# EAGLE design Qwiic_OLED_1.3in (EAGLE 9.6.2)
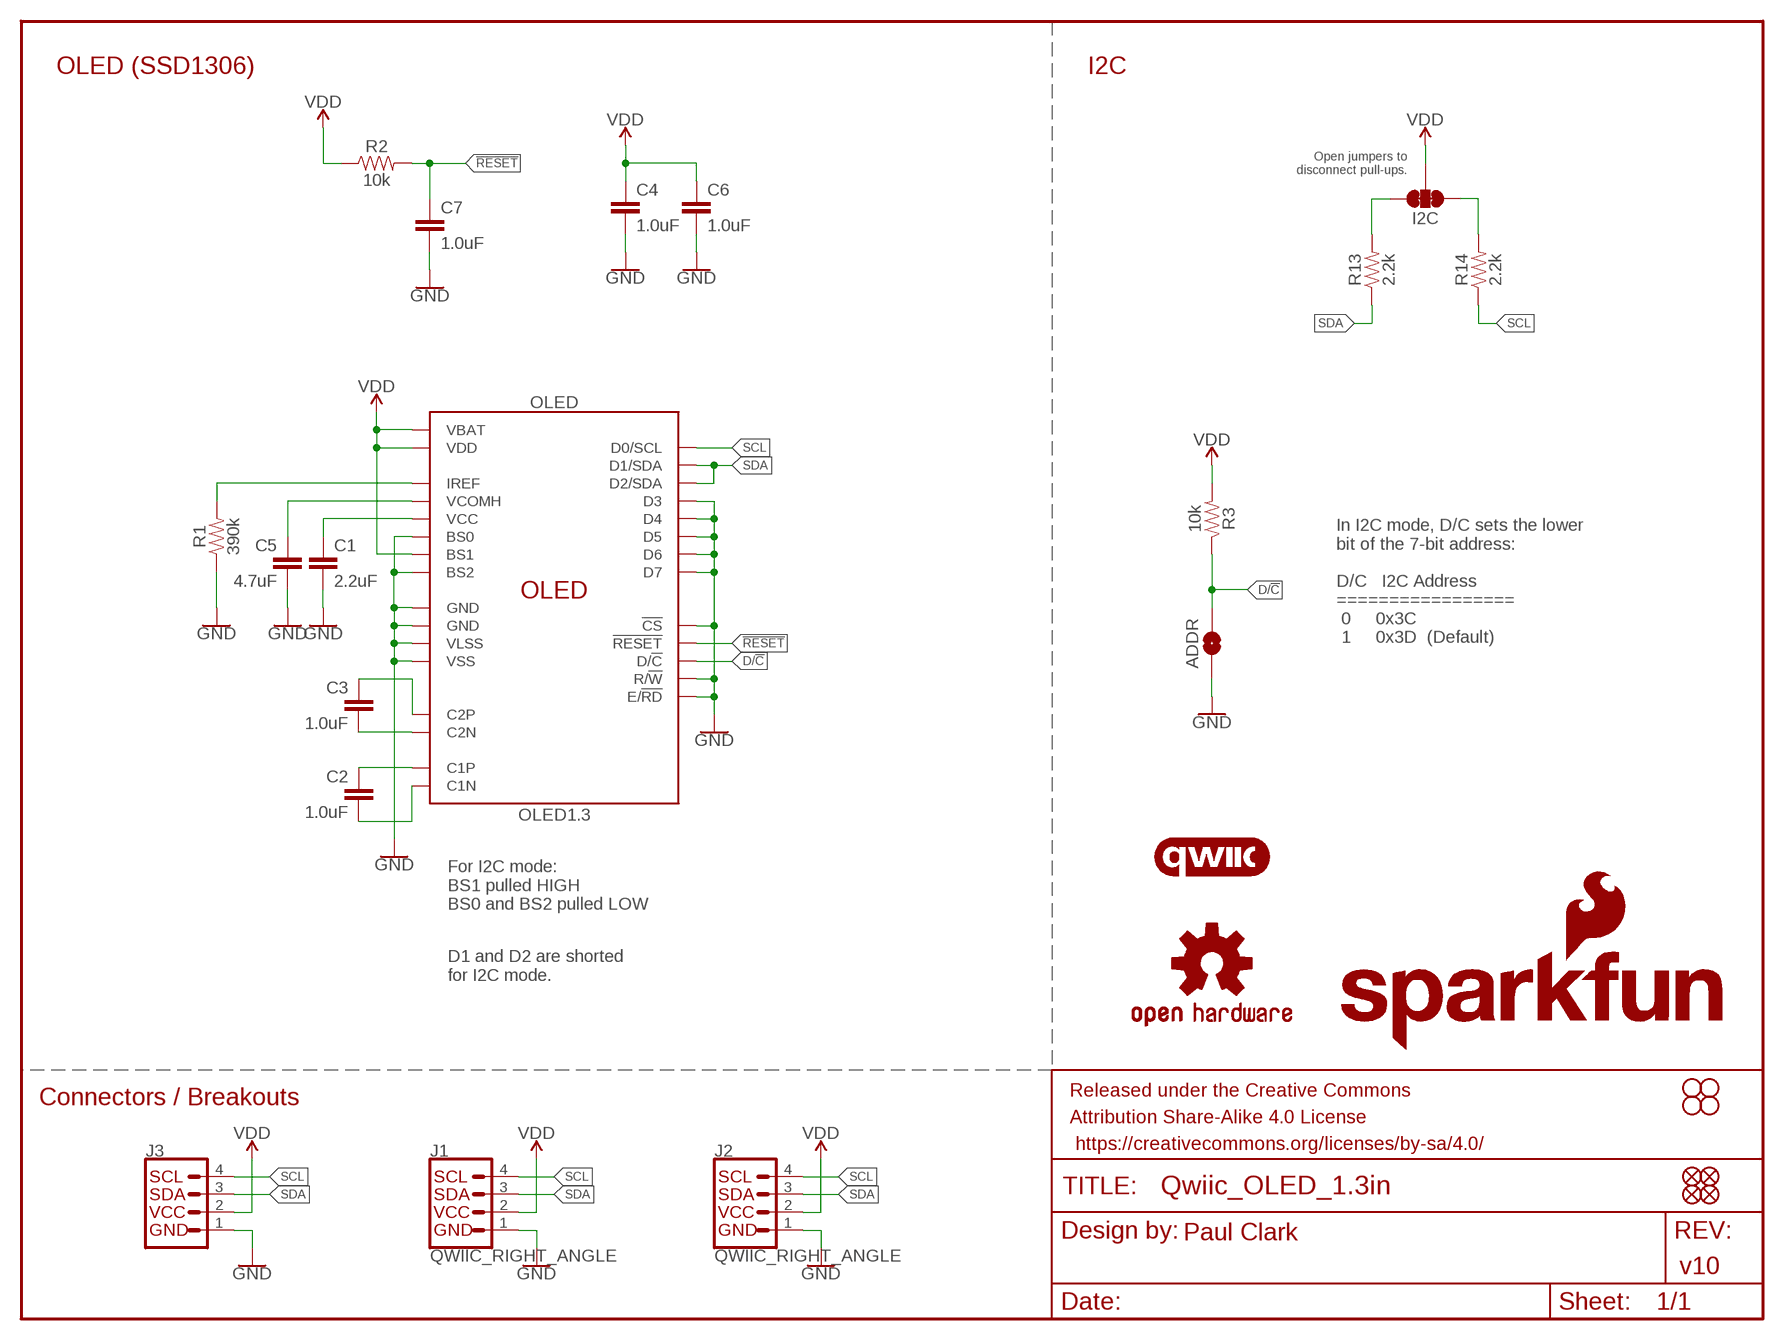
[diagram p0: schematic, sheet 1]

## Parts
ADDR  JUMPER-SMT_2_NO_SILK  [SMT-JUMPER_2_NO_SILK]
C1  2.2uF  2.2UF-0603-10V-20%  [0603]
C2  1.0uF  1.0UF-0603-16V-10%-X7R  [0603]
C3  1.0uF  1.0UF-0603-16V-10%-X7R  [0603]
C4  1.0uF  1.0UF-0603-16V-10%-X7R  [0603]
C5  4.7uF  4.7UF-0603-35V-(20%)  [0603]
C6  1.0uF  1.0UF-0603-16V-10%-X7R  [0603]
C7  1.0uF  1.0UF-0603-16V-10%-X7R  [0603]
FID1  FIDUCIAL1X2  [FIDUCIAL-1X2]
FID2  FIDUCIAL1X2  [FIDUCIAL-1X2]
FID3  FIDUCIAL1X2  [FIDUCIAL-1X2]
FID4  FIDUCIAL1X2  [FIDUCIAL-1X2]
FRAME1  FRAME-LETTER  [CREATIVE_COMMONS]
H1  STAND-OFF  [STAND-OFF]
H2  STAND-OFF  [STAND-OFF]
H3  STAND-OFF  [STAND-OFF]
H4  STAND-OFF  [STAND-OFF]
I2C  JUMPER-SMT_3_2-NC_TRACE_SILK  [SMT-JUMPER_3_2-NC_TRACE_SILK]
J1  QWIIC_RIGHT_ANGLE  QWIIC_CONNECTORJS-1MM  [JST04_1MM_RA]
J2  QWIIC_RIGHT_ANGLE  QWIIC_CONNECTORJS-1MM  [JST04_1MM_RA]
J3  I2C_STANDARD_NO_SILK  [1X04_NO_SILK]
LOGO1  QWIIC_LOGO_6MM  [QWIIC_6MM]
LOGO3  OSHW-LOGOS  [OSHW-LOGO-S]
LOGO4  SFE_LOGO_NAME_FLAME.1_INCH  [SFE_LOGO_NAME_FLAME_.1]
OLED  OLED1.3  [OLED-1.3-128X64]
R1  390k  390KOHM-0603-1/10W-1%  [0603]
R2  10k  10KOHM-0603-1/10W-1%  [0603]
R3  10k  10KOHM-0603-1/10W-1%  [0603]
R13  2.2k  2.2KOHM-0603-1/10W-1%  [0603]
R14  2.2k  2.2KOHM-0603-1/10W-1%  [0603]

## Nets
!RESET!: C7.1 OLED.14(!RESET!) R2.2
C1N: C2.2 OLED.5(C1N)
C1P: C2.1 OLED.4(C1P)
C2N: C3.2 OLED.3(C2N)
C2P: C3.1 OLED.2(C2P)
D/!C!: ADDR.2 OLED.15(D/!C!) R3.1
GND: ADDR.1 C1.2 C4.2 C5.2 C6.2 C7.2 J1.1 J2.1 J3.1(GND) OLED.1(GND) OLED.8(VSS) OLED.10(BS0) OLED.12(BS2) OLED.13(!CS!) OLED.16(R/!W!) OLED.17(E/!RD!) OLED.21(D3) OLED.22(D4) OLED.23(D5) OLED.24(D6) OLED.25(D7) OLED.29(VLSS) OLED.30(GND) R1.1
IREF: OLED.26(IREF) R1.2
N$4: I2C.3 R13.2
N$5: I2C.1 R14.2
SCL: J1.4 J2.4 J3.4(SCL) OLED.18(D0/SCL) R14.1
SDA: J1.3 J2.3 J3.3(SDA) OLED.19(D1/SDA) OLED.20(D2/SDA) R13.1
VCC: C1.1 OLED.28(VCC)
VCOMH: C5.1 OLED.27(VCOMH)
VDD: C4.1 C6.1 I2C.2 J1.2 J2.2 J3.2(VCC) OLED.6(VBAT) OLED.9(VDD) OLED.11(BS1) R2.1 R3.2

## Notes on the sheet
- OLED (SSD1306) | I2C
- Open jumpers to
  disconnect pull-ups.
- In I2C mode, D/C sets the lower
  bit of the 7-bit address:
  
  D/C   I2C Address
  =================
   0     0x3C
   1     0x3D  (Default)
- For I2C mode:
  BS1 pulled HIGH
  BS0 and BS2 pulled LOW
- D1 and D2 are shorted
  for I2C mode.
- Connectors / Breakouts
- Paul Clark
- v10

## Library data of the parts
ADDR = SparkFun-Jumpers:JUMPER-SMT_2_NO: Normally open jumper This jumper has two pads in close proximity to each other. Apply solder to close the connection. Round pads are easier to solder for beginners, but are a lot larger. SparkFun Product that uses the round pads: SparkFun EL Sequencer <https://www.sparkfun.com/products/12781>
C1 = SparkFun-Capacitors:2.2UF: 2.2µF ceramic capacitors A capacitor is a passive two-terminal electrical component used to store electrical energy temporarily in an electric field.; PROD_ID: CAP-07888
C2-C4 C6 C7 = SparkFun-Capacitors:1.0UF: 1µF ceramic capacitors A capacitor is a passive two-terminal electrical component used to store electrical energy temporarily in an electric field.; PROD_ID: CAP-13930
C5 = SparkFun-Capacitors:4.7UF: 4.7µF ceramic capacitors A capacitor is a passive two-terminal electrical component used to store electrical energy temporarily in an electric field.; PROD_ID: CAP-14106
FID1-FID4 = SparkFun-Aesthetics:FIDUCIAL: Fiducial Alignment Points Point-of-reference for pick-and-place machines and other optical instruments.
FRAME1 = SparkFun-Aesthetics:FRAME-LETTER: Schematic Frame - Letter Standard 8.5x11 US Letter frame
H1-H4 = SparkFun-Hardware:STAND-OFF: Stand Off Drill holes for mechanically mounting via screws, standoffs, etc. Note: Use the keepout ring to avoid running the screw head into surrounding components. Variant Overviews STAND-OFF - Mechanical footprint for a #4 phillips button head screw. STAND-OFF-TIGHT - Mechanical footprint for a #4 phillips button head screw, Example SparkFun Products Screw - Phillips Head (1/4", 4-40, 10 pack) <https://www.sparkfun.com/products/10453> (PRT-10453) Screw - Phillips Head (1/2", 4-40, 10 pack) <https://www.sparkfun.com/products/10452> (PRT-10452) Screw - Phillips Head (3/4", 4-40, 10 pack) <https://www.sparkfun.com/products/10451> (PRT-10451) Screw - Phillips Head (1", 4-40, 10 pack) <https://www.sparkfun.com/products/10450> (PRT-10450)
I2C = SparkFun-Jumpers:JUMPER-SMT_3_2-NC_TRACE: Normally closed trace jumper (2 of 2 connections) This jumper has a trace between all three pads so they are normally closed (NC). Use a razor knife to open the connection(s). For best results follow the IPC guidelines for cutting traces: Cutout at least 0.063 mm (0.005 in). Remove all loose material to clean up the cut area. Seal the cut with an approved epoxy. Reapply solder to reclose the connection(s).
J1 J2 = SparkFun-Connectors:QWIIC_CONNECTOR: SparkFun I2C Standard Qwiic Connector An SMD 1mm pitch JST connector makes it easy and quick (get it? Qwiic?) to connect I2C devices to each other. The Qwiic system <http://www.sparkfun.com/qwiic> enables fast and solderless connection between popular platforms and various sensors and actuators. We carry 200mm <https://www.sparkfun.com/products/14204>, 100mm <https://www.sparkfun.com/products/14205>, 50mm <https://www.sparkfun.com/products/14206>, and breadboard friendly <https://www.sparkfun.com/products/14207> Qwiic cables. We also offer 10 pcs strips <https://www.sparkfun.com/products/14323> the SMD connectors.; PROD_ID: CONN-13694
J3 = SparkX:I2C_STANDARD: SparkFun I2C Standard Pinout Header SparkFun has standardized on a pinout for all I2C based sensor breakouts. This pinout allows I2C boards to be plugged directly into the headers on Arduino Uno compatible boards, and to be daisy chained easily. Example SparkFun Products: SparkFun Atmospheric Sensor Breakout - BME280 <https://www.sparkfun.com/products/13676> SparkFun Altitude/Pressure Sensor Breakout - MPL3115A2 <https://www.sparkfun.com/products/11084> SparkFun TOF Range Finder Sensor - VL6180 <https://www.sparkfun.com/products/12785>
LOGO1 = SparkFun-Aesthetics:QWIIC_LOGO: Qwiic Logos for placement on schematic and PCB. The 5.5mm silk logo is best for placing next to Qwiic connector.
LOGO3 = SparkFun-Aesthetics:OSHW-LOGO: Open-Source Hardware (OSHW) Logo This logo indicates the piece of hardware it is found on incorporates a OSHW license and/or adheres to the definition of open source hardware found here: http://freedomdefined.org/OSHW
LOGO4 = SparkFun-Aesthetics:SFE_LOGO_NAME_FLAME: SparkFun Font Logo w/ Flame This is the SparkFun full logo. The logo on the schematic will always be the same size; the package variant is the height of the flame part of the logo. Default layer for the logo on the board is tSilk.
OLED = OLED_1.3in:OLED1.3: OLED 1.3" 128x64 SSD1306; PROD_ID: LCD-19994
R1 = SparkFun-Resistors:390KOHM: 390kΩ resistor A resistor is a passive two-terminal electrical component that implements electrical resistance as a circuit element. Resistors act to reduce current flow, and, at the same time, act to lower voltage levels within circuits. - Wikipedia; PROD_ID: RES-12024
R2 R3 = SparkFun-Resistors:10KOHM: 10kΩ resistor A resistor is a passive two-terminal electrical component that implements electrical resistance as a circuit element. Resistors act to reduce current flow, and, at the same time, act to lower voltage levels within circuits. - Wikipedia; PROD_ID: RES-00824
R13 R14 = SparkFun-Resistors:2.2KOHM: 2.2kΩ resistor A resistor is a passive two-terminal electrical component that implements electrical resistance as a circuit element. Resistors act to reduce current flow, and, at the same time, act to lower voltage levels within circuits. - Wikipedia; PROD_ID: RES-08272

## Board
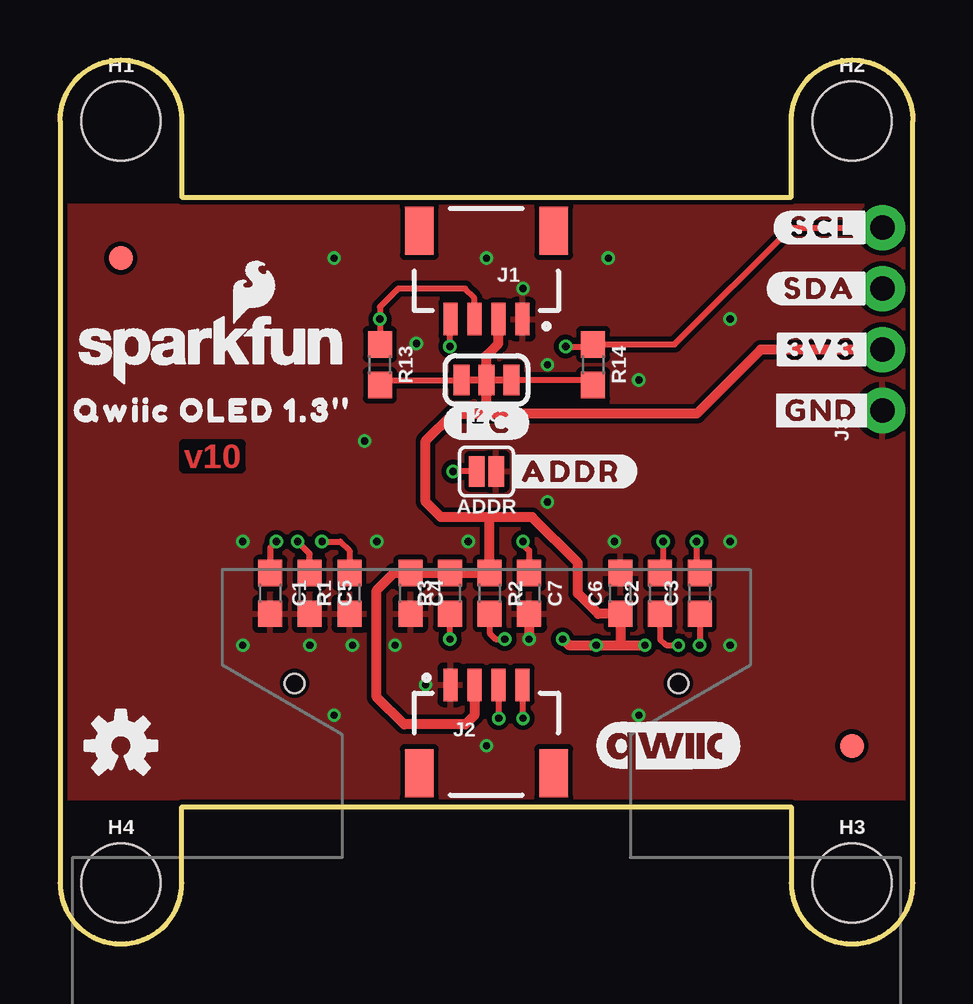
[diagram p1: board, top side]
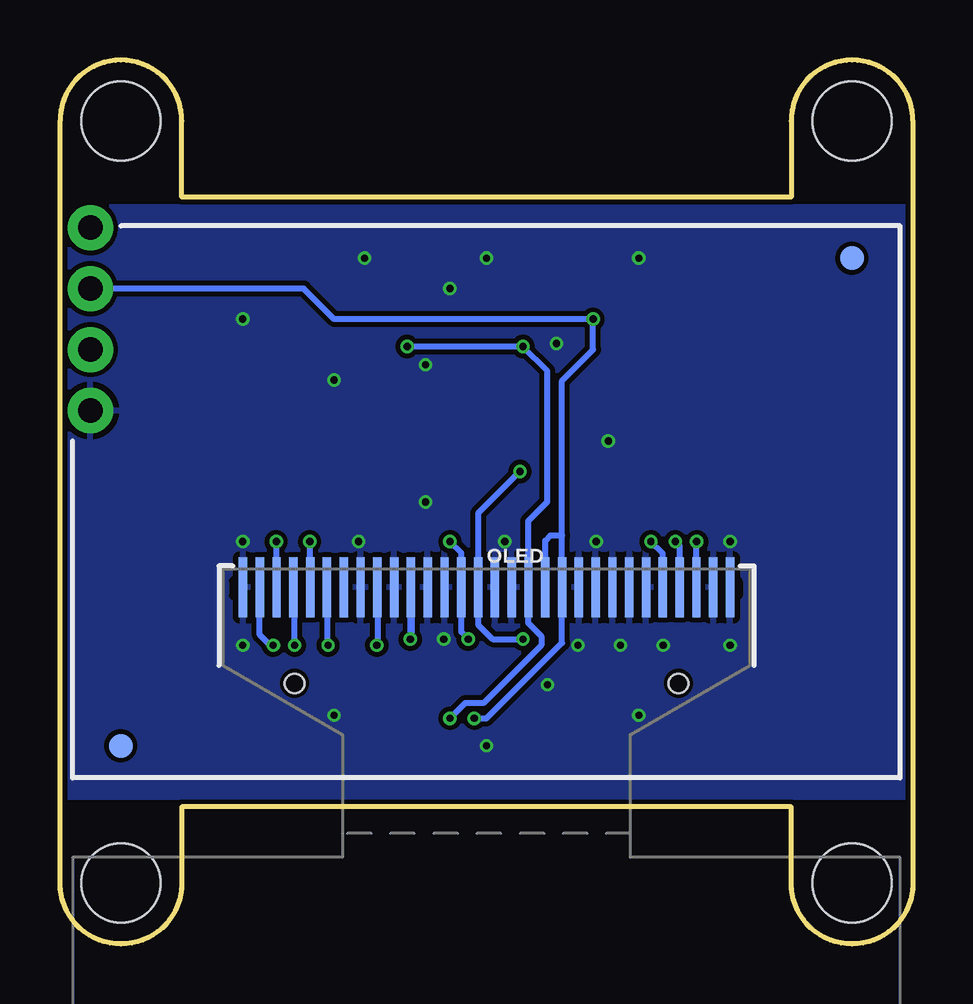
[diagram p2: board, bottom side, seen from below]

Size 35.56 x 36.83 mm. Coordinates in mm from the lower left corner, seen from the top.
Outline: 35.56,2.54 35.56,34.29 arc90 33.02,36.83 arc90 30.48,34.29 30.48,31.11 5.08,31.11 5.08,34.29 arc90 2.54,36.83 arc90 0,34.29 0,2.54 arc90 2.54,0 arc90 5.08,2.54 5.08,5.71 30.48,5.71 30.48,2.54 arc90 33.02,0 arc90 35.56,2.54
Copper layers (1*16): Top 0.035mm / dielectric 1.5mm / Bottom 0.035mm
Design rules "SparkFun-2-Layer-Minimum-JLCPCB": minimum track width 5mil, minimum drill 0.3mm, track to track 5mil, track to pad 5mil, pad to pad 5mil, via to via 5mil, smd to smd 5mil, copper to edge 7mil, drill to drill 7mil, minimum pad ring 5mil, minimum via ring 5mil, stop-mask expansion 2.5mil, vias tented up to drill 25mil, thermal gap 10mil
bRestrict: 9 lines

### Footprints (pad centres in the part's own frame; a part is rotated, then mirrored left to right if it is on the bottom)
SMT-JUMPER_2_NO_SILK = smd 0.635 x 1.27: 1 -0.406,0; 2 0.406,0
0603 = smd 1.1 x 1: 1 -0.85,0; 2 0.85,0
FIDUCIAL-1X2 = smd 1 x 1: 1 0,0
STAND-OFF = hole 3.302: 0,0
SMT-JUMPER_3_2-NC_TRACE_SILK = smd 0.66 x 1.27: 1 -1.041,0; 2 0,0; 3 1.041,0
JST04_1MM_RA = smd 0.6 x 1.35: 1 -1.5,0; 2 -0.5,0; 3 0.5,0; 4 1.5,0 | smd 1.2 x 2: NC1 2.8,-3.675; NC2 -2.8,-3.675
1X04_NO_SILK = drill 1.016 pad 1.88: 1 0,0; 2 2.54,0; 3 5.08,0; 4 7.62,0
OLED-1.3-128X64 = smd 0.35 x 2.5: 1 -10.15,0.25; 2 -9.45,0.25; 3 -8.75,0.25; 4 -8.05,0.25; 5 -7.35,0.25; 6 -6.65,0.25; 7 -5.95,0.25; 8 -5.25,0.25; 9 -4.55,0.25; 10 -3.85,0.25; 11 -3.15,0.25; 12 -2.45,0.25; 13 -1.75,0.25; 14 -1.05,0.25; 15 -0.35,0.25; 16 0.35,0.25; 17 1.05,0.25; 18 1.75,0.25; 19 2.45,0.25; 20 3.15,0.25; 21 3.85,0.25; 22 4.55,0.25; 23 5.25,0.25; 24 5.95,0.25; 25 6.65,0.25; 26 7.35,0.25; 27 8.05,0.25; 28 8.75,0.25; 29 9.45,0.25; 30 10.15,0.25 | hole 0.8: 8,-3.75; -8,-3.75

### Placement (x,y rotation side)
ADDR  17.78,19.69 180 top
C1  8.76,14.61 270 top
C2  25.02,14.61 90 top
C3  26.67,14.61 90 top
C4  14.61,14.61 270 top
C5  10.41,14.61 270 top
C6  23.37,14.61 90 top
C7  19.56,14.61 270 top
FID1  33.02,8.25 0 top
FID2  2.54,28.57 0 top
FID3  2.54,28.57 0 bottom
FID4  33.02,8.25 0 bottom
FRAME1  -19.05,-31.11 0 top  (outside the outline)
H1  2.54,34.29 0 top
H2  33.02,34.29 0 top
H3  33.02,2.54 0 top
H4  2.54,2.54 0 top
I2C  17.78,23.5 180 top
J1  17.78,26.04 180 top
J2  17.78,10.79 0 top
J3  34.29,22.23 90 top
LOGO1  25.4,8.25 0 top
LOGO3  2.54,8.25 0 top
LOGO4  6.35,24.77 0 top
OLED  17.78,14.61 0 bottom
R1  12.06,14.61 90 top
R2  17.91,14.61 270 top
R3  16.26,14.61 90 top
R13  13.34,24.13 270 top
R14  22.23,24.13 270 top
U$1  [QWIIC_OLED_1#3##0]  6.35,22.23 0 top
U$2  [#I�C#2]  17.78,21.72 0 top
U$3  [#3V3#2]  31.75,24.77 0 top
U$4  [#ADDR#5]  18.54,19.69 0 top
U$5  [#GND#4]  31.75,22.23 0 top
U$6  [#SCL#0]  33.91,29.84 0 top
U$7  [#SDA#1]  33.91,27.3 0 top

### Tracks (layer width: path | path; a pad name or v marks a point on that pad's centre or on a via)
!RESET!  (via drill 0.3)
  Top 0.254: R2.2 17.91,12.95 18.16,12.7 v18.54,12.7 | v19.3,16.76 19.3,16.64 19.56,16.38 C7.1
  Bottom 0.254: v18.54,12.7 18.83,12.99 OLED.14 18.83,16.29 v19.3,16.76
C1N  (via drill 0.3)
  Top 0.254: C2.2 25.15,15.58 v25.15,16.76
  Bottom 0.254: v25.15,16.76 25.15,14.87 OLED.5
C1P  (via drill 0.3)
  Top 0.254: C2.1 25.02,12.7 25.27,12.45 v25.78,12.45
  Bottom 0.254: v25.78,12.45 25.78,14.81 OLED.4
C2N  (via drill 0.3)
  Top 0.254: C3.2 26.54,15.58 v26.54,16.76
  Bottom 0.254: v26.54,16.76 26.54,14.87 OLED.3
C2P  (via drill 0.3)
  Top 0.254: C3.1 v26.67,12.45
  Bottom 0.254: v26.67,12.45 26.8,12.45 27.23,12.88 OLED.2
D/!C!  (via drill 0.3)
  Top 0.254: v16.26,12.7 R3.1 | ADDR.2 v16.38,19.69
  Bottom 0.254: v16.26,12.7 17.53,12.7 18.13,13.3 OLED.15 18.13,17.94 v16.38,19.69
GND  (via drill 0.3)
  Top 0.406: C7.2 v19.56,12.7
  other vias: 17.02,16.76 27.94,16.76 27.94,12.45 7.62,12.45 7.62,16.76 12.19,12.45 13.21,16.76 10.41,12.45 13.97,12.45 19.3,27.3 15.24,10.79 23.11,16.76 24.13,23.5 27.94,26.04 14.86,25.02 11.43,28.57 12.7,20.95 11.43,9.53 24.13,9.53 22.86,28.57 17.78,8.25 17.78,28.57 20.32,18.41 20.32,24.13
  pour Bottom (isolate 0.203): 35.56,6.1 35.56,30.73 0,30.73 0,6.1
  pour Top (isolate 0.203): 35.56,6.1 35.56,30.73 0,30.73 0,6.1
IREF  (via drill 0.3)
  Top 0.254: v10.92,16.76 11.68,16.76 12.06,16.38 R1.2
  Bottom 0.254: OLED.26 10.43,16.27 v10.92,16.76
N$4
  Top 0.254: R13.2 13.55,23.5 I2C.3
N$5
  Top 0.254: R14.2 22.01,23.5 I2C.1
SCL  (via drill 0.3)
  Top 0.254: J2.4 19.28,9.42 v19.3,9.4 | v16.26,24.89 16.26,26.01 J1.4 | v21.08,24.89 22.14,24.89 R14.1 25.61,24.98 30.48,29.84 J3.4
  Bottom 0.254: v21.08,24.89 v16.26,24.89 15.24,23.88 15.24,18.41 16.03,17.62 OLED.18 16.03,13.36 15.49,12.83 15.49,12.45 17.91,10.03 18.67,10.03 v19.3,9.4
SDA  (via drill 0.3)
  Top 0.254: v18.29,9.4 18.28,9.41 J2.3 | R13.1 v13.34,26.04 13.34,26.54 14.1,27.3 16.89,27.3 17.28,26.92 J1.3
  Bottom 0.254: v18.29,9.4 17.78,9.4 14.63,12.55 OLED.20 14.63,17.02 | 14.63,17.02 14.63,23.47 13.34,24.77 v13.34,26.04 24.13,26.04 25.4,27.3 J3.3 | OLED.19 15.33,16.8 15.11,17.02 14.63,17.02
VCC  (via drill 0.3)
  Top 0.254: v9.02,16.76 8.76,16.51 C1.1
  Bottom 0.254: OLED.28 9.03,16.75 v9.02,16.76
VCOMH  (via drill 0.3)
  Top 0.254: C5.1 10.41,16.26 v9.91,16.76
  Bottom 0.254: v9.91,16.76 9.73,16.59 OLED.27
VDD  (via drill 0.3)
  Top 0.406: J2.2 17.28,9.53 16.9,9.14 14.35,9.14 13.21,10.29 13.21,14.73 13.93,15.46 C4.1 R3.2 R2.1 17.91,17.78 | 17.78,22.1 I2C.2 17.78,24.51 18.28,25.01 J1.2 | 17.91,17.78 19.68,17.78 21.59,15.88 21.59,14.61 22.44,13.75 C6.1 23.37,12.45 | 23.37,12.45 v22.35,12.45 21.21,12.45 v20.95,12.7 | 23.37,12.45 v24.38,12.45 | J3.2 29.21,24.77 26.54,22.1 17.78,22.1 | 17.91,17.78 15.88,17.78 15.24,18.41 15.24,20.95 16.38,22.1 17.78,22.1
  Bottom 0.254: OLED.6 24.43,12.49 v24.38,12.45 | OLED.9 22.33,12.47 v22.35,12.45
  Bottom 0.305: OLED.11 20.93,12.72 v20.95,12.7

### Text on the board
Top: v10
Measures: Dimensions / in Inches
tDocu: Paul Clark